# EasyEDA schematic Bumper copy.json
TITLE: Bumper; REV: 1.0; Date: 2023-11-20; Sheet: 1/1; Drawn By: Ryan Bazzell; Company: Cedarville University
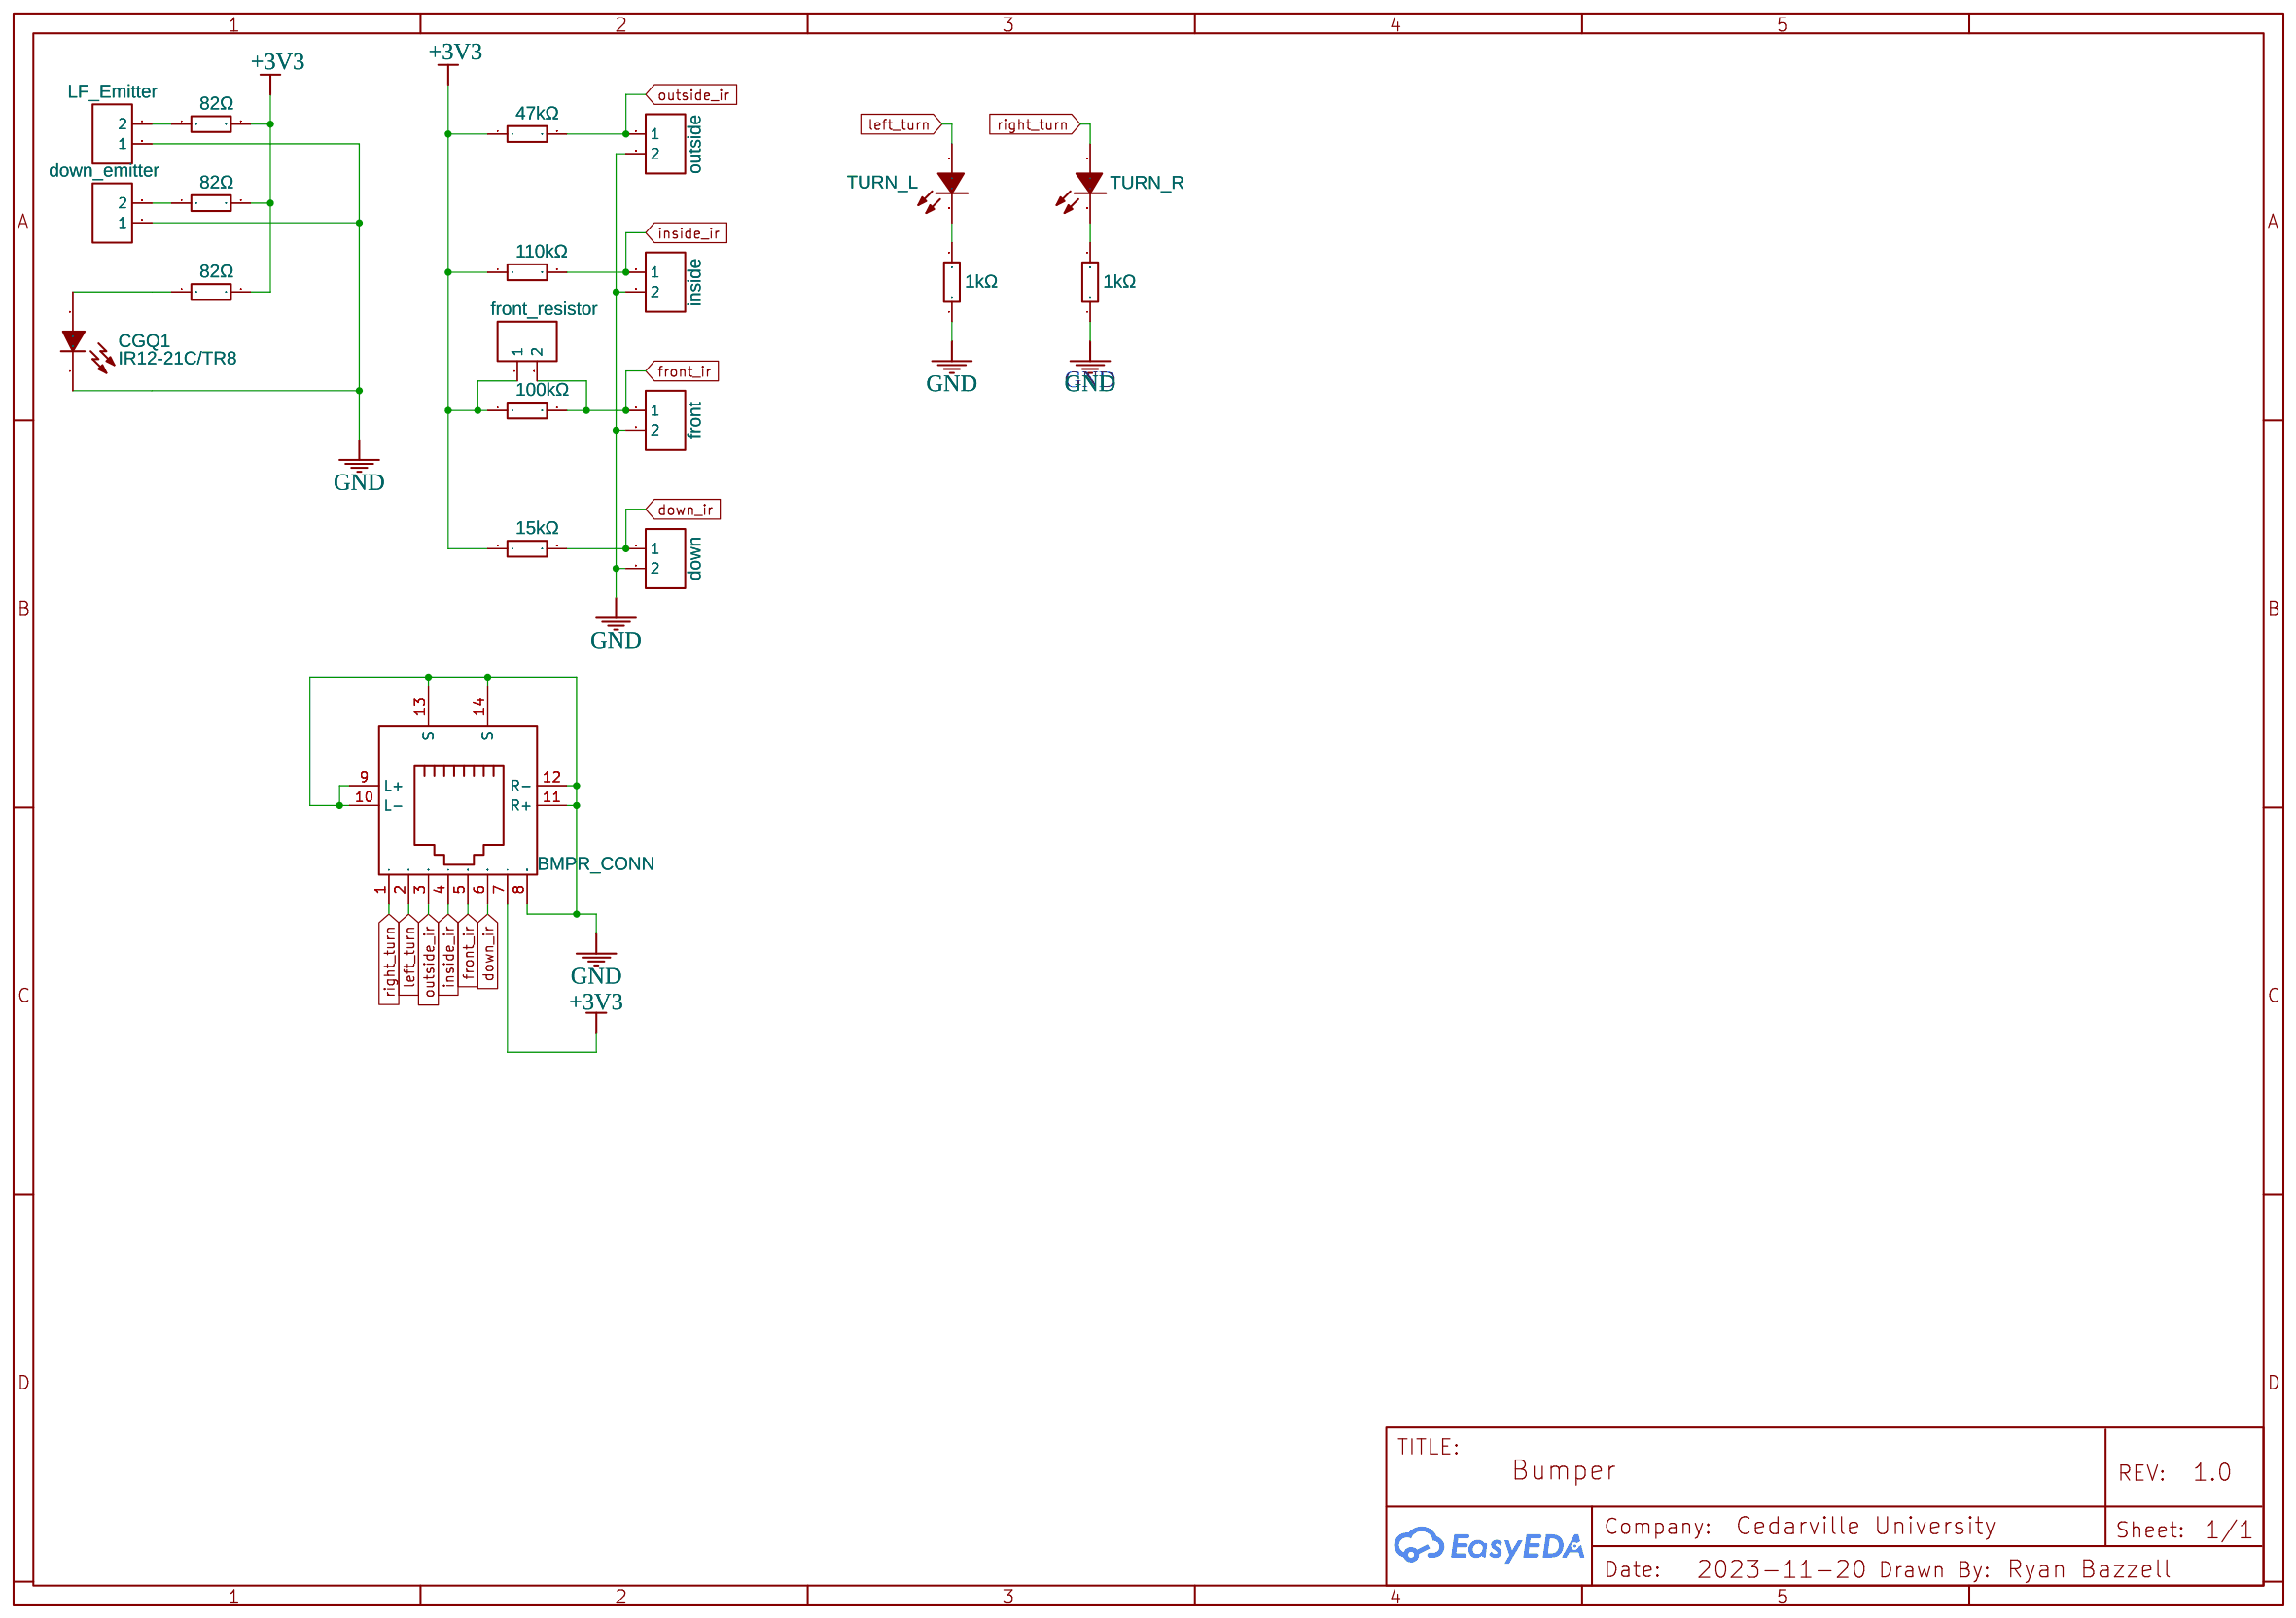
[diagram p0: schematic sheet]

## Parts
BMPR_CONN  R-RJ45R08P-C000  [RJ45-TH_R-RJ45R08P-C000]
CGQ1  IR12-21C/TR8  [SENSOR-SMD_IR12-21C-TR8]
DOWN  down  [HDR-F-2.54_1X2]
DOWN_EMITTER  down_emitter  [HDR-F-2.54_1X2]
FRONT  front  [HDR-F-2.54_1X2]
FRONT1  front_resistor  [HDR-F-2.54_1X2]
INSIDE  inside  [HDR-F-2.54_1X2]
LF_EMITTER  LF_Emitter  [HDR-F-2.54_1X2]
OUTSIDE  outside  [HDR-F-2.54_1X2]
R1  82Ω  [R0603]
R2  82Ω  [R0603]
R3  82Ω  [R0603]
R4  1kΩ  [R0402]
R5  1kΩ  [R0402]
R6  100kΩ  [R0603]
R7  15kΩ  [R0603]
R8  110kΩ  [R0603]
R9  47kΩ  [R0603]
TURN_L  17-21SUYC/TR8  [LED0805-R-RD]
TURN_R  17-21SUYC/TR8  [LED0805-R-RD]

## Library data of the parts
BMPR_CONN = R-RJ45R08P-C000: Contributor: LCSC; Supplier: LCSC; Supplier Part: C386757; Manufacturer: Ckmtw(灿科盟); JLCPCB Part Class: Extended Part
CGQ1 = IR12-21C/TR8: Supplier: LCSC; Manufacturer: EVERLIGHT(亿光); Supplier Part: C53672; JLCPCB Part Class: Extended Part
DOWN DOWN_EMITTER FRONT FRONT1 INSIDE LF_EMITTER OUTSIDE = HDR-F-2.54_1x2: Supplier Part: C49661; Supplier: LCSC; Contributor: LCEDA_Lib
R1-R3 = 0603WAF820JT5E: Supplier: LCSC; Manufacturer: UNI-ROYAL(厚声); Supplier Part: C23255; JLCPCB Part Class: Extended Part
R4 R5 = 0402WGF1001TCE: Supplier: LCSC; Manufacturer: UNI-ROYAL(厚声); Supplier Part: C11702; JLCPCB Part Class: Basic Part
R6 = 0603WAF1003T5E: Supplier: LCSC; Manufacturer: UNI-ROYAL(厚声); Supplier Part: C25803; JLCPCB Part Class: Basic Part
R7 = 0603WAF1502T5E: Supplier: LCSC; Manufacturer: UNI-ROYAL(厚声); Supplier Part: C22809; JLCPCB Part Class: Basic Part
R8 = 0603WAF1103T5E: Supplier: LCSC; Manufacturer: UNI-ROYAL(厚声); Supplier Part: C25805; JLCPCB Part Class: Extended Part
R9 = 0603WAF4702T5E: Supplier: LCSC; Manufacturer: UNI-ROYAL(厚声); Supplier Part: C25819; JLCPCB Part Class: Basic Part
TURN_L TURN_R = 17-21SUYC/TR8: Supplier: LCSC; Manufacturer: KENTO; Manufacturer Part: KT-0805黄灯; Supplier Part: C2296; JLCPCB Part Class: Basic Part

## Nets
+3V3: BMPR_CONN.7 FRONT1.1 R1.2 R2.2 R3.2 R6.1 R7.1 R8.1 R9.1
GND: BMPR_CONN.8 BMPR_CONN.9(L+) BMPR_CONN.10(L-) BMPR_CONN.11(R+) BMPR_CONN.12(R-) BMPR_CONN.13(S) BMPR_CONN.14(S) CGQ1.1(C) DOWN.2 DOWN_EMITTER.1 FRONT.2 INSIDE.2 LF_EMITTER.1 OUTSIDE.2 R4.1 R5.1
down_ir: BMPR_CONN.6 DOWN.1 R7.2
front_ir: BMPR_CONN.5 FRONT.1 FRONT1.2 R6.2
inside_ir: BMPR_CONN.4 INSIDE.1 R8.2
left_turn: BMPR_CONN.2 TURN_L.1(+)
outside_ir: BMPR_CONN.3 OUTSIDE.1 R9.2
right_turn: BMPR_CONN.1 TURN_R.1(+)
Net-(CGQ1-2): CGQ1.2(A) R3.1
Net-(DOWN_EMITTER-2): DOWN_EMITTER.2 R2.1
Net-(LF_EMITTER-2): LF_EMITTER.2 R1.1
Net-(R4-2): R4.2 TURN_L.2(-)
Net-(R5-2): R5.2 TURN_R.2(-)

## Notes on the sheet
- GND
